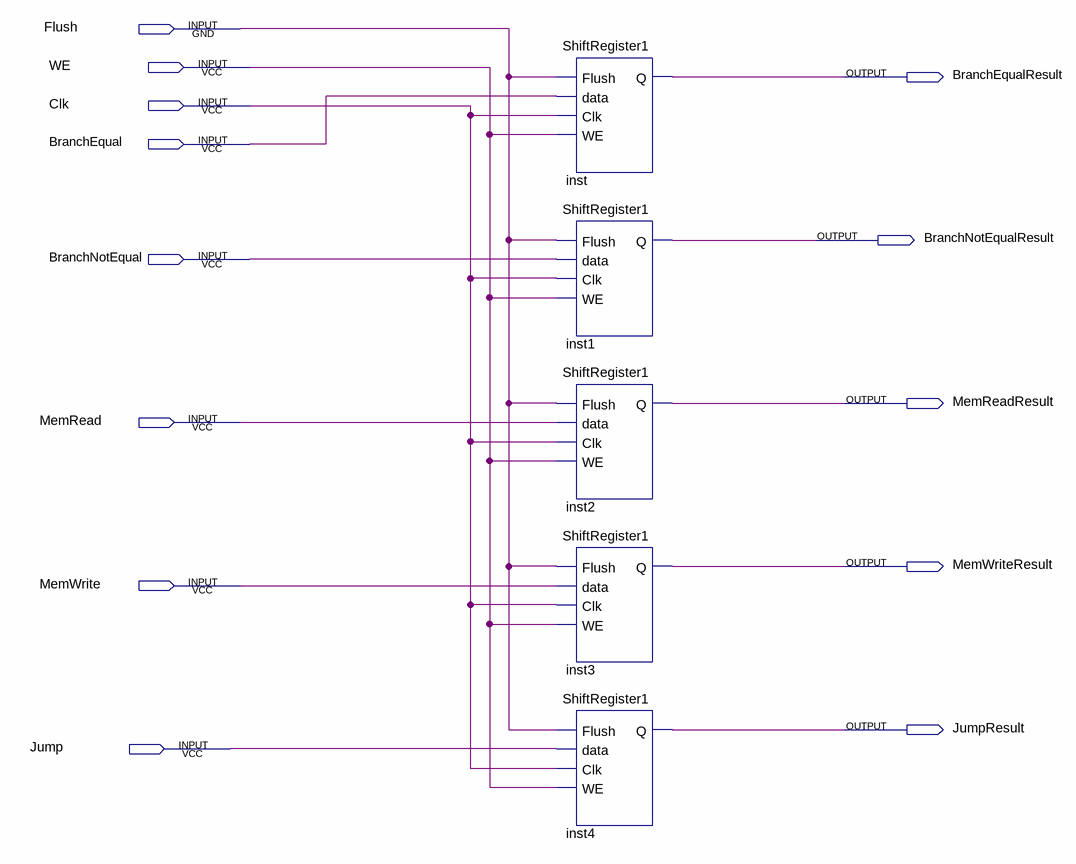
[diagram p0: schematic sheet]
// Quartus schematic MEM_Register.bdf as structural Verilog: 5 symbols, 13 pins
module MEM_Register (
  input  Flush,
  input  WE,
  input  Clk,
  input  BranchEqual,
  input  BranchNotEqual,
  input  MemRead,
  input  MemWrite,
  input  Jump,
  output BranchEqualResult,
  output BranchNotEqualResult,
  output MemReadResult,
  output MemWriteResult,
  output JumpResult
);

  ShiftRegister1 inst (.Flush(Flush), .data(BranchEqual), .Clk(Clk), .WE(WE), .Q(BranchEqualResult));
  ShiftRegister1 inst1 (.Flush(Flush), .data(BranchNotEqual), .Clk(Clk), .WE(WE), .Q(BranchNotEqualResult));
  ShiftRegister1 inst2 (.Flush(Flush), .data(MemRead), .Clk(Clk), .WE(WE), .Q(MemReadResult));
  ShiftRegister1 inst3 (.Flush(Flush), .data(MemWrite), .Clk(Clk), .WE(WE), .Q(MemWriteResult));
  ShiftRegister1 inst4 (.Flush(Flush), .data(Jump), .Clk(Clk), .WE(WE), .Q(JumpResult));
endmodule
